# EAGLE schematic ESP-12E Dev Board_with_level_shifter (EAGLE 9.4.0)

## Sheet 1 of 2
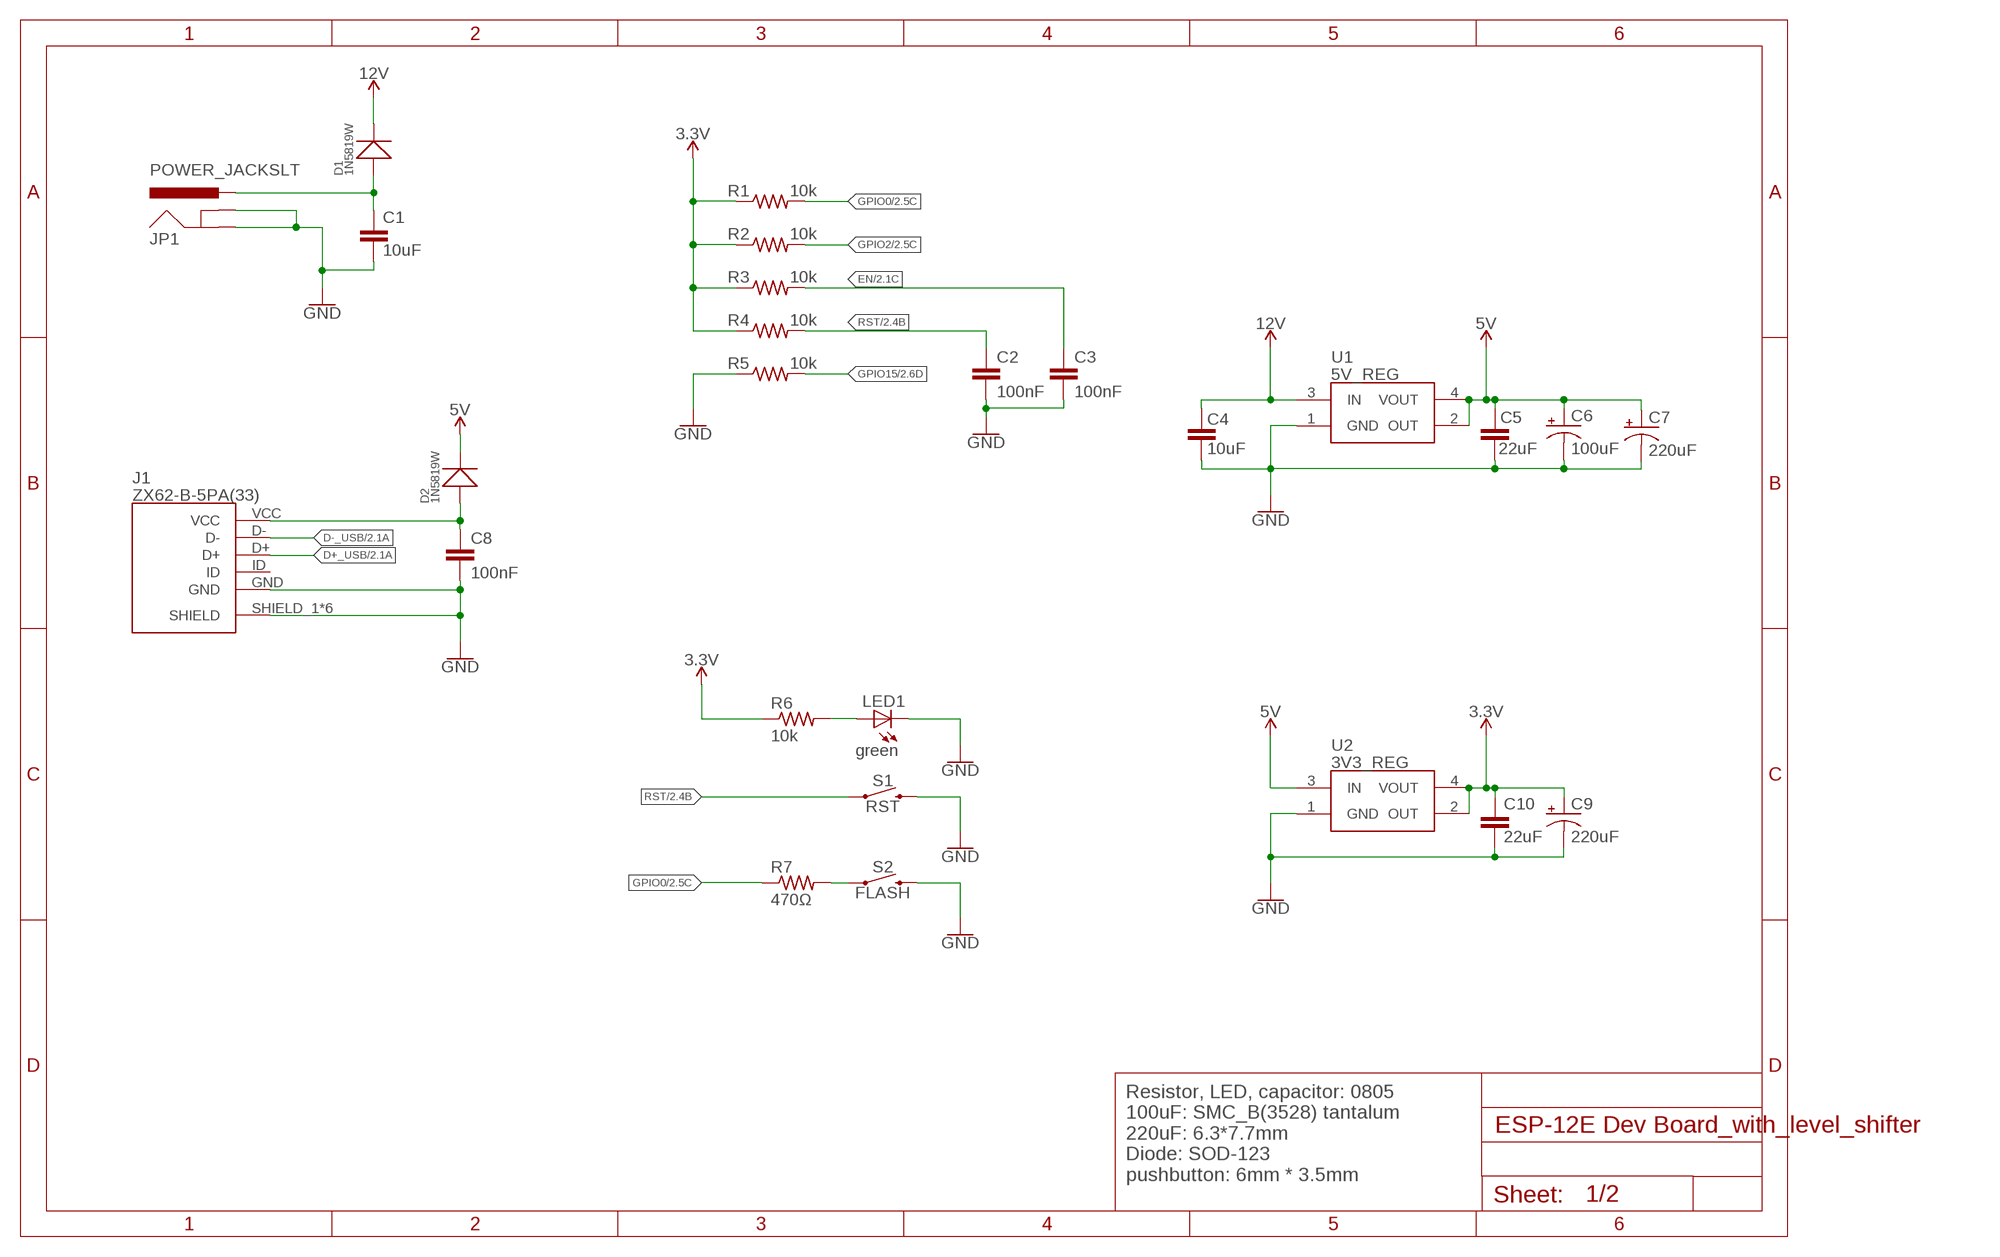
[diagram p0: schematic, sheet 1]

### Parts
C1  10uF  C-EUC0805  [C0805]
C2  100nF  C-EUC0805  [C0805]
C3  100nF  C-EUC0805  [C0805]
C4  10uF  C-EUC0805  [C0805]
C5  22uF  C-EUC0805  [C0805]
C6  100uF  CPOL-USSMCB  [SMC_B]
C7  220uF  CPOL-USUD-6,3X7,7  [UD-6,3X7,7_NICHICON]
C8  100nF  C-EUC0805  [C0805]
C9  220uF  CPOL-USUD-6,3X7,7  [UD-6,3X7,7_NICHICON]
C10  22uF  C-EUC0805  [C0805]
D1  1N5819W  SMD-DIODE-SCHOTTKY-20V-500MA(SOD-123)  [SOD-123]
D2  1N5819W  SMD-DIODE-SCHOTTKY-20V-500MA(SOD-123)  [SOD-123]
J1  ZX62-B-5PA(33)  [ZX62B5PA33]
JP1  POWER_JACKSLT  [POWER_JACK_SLOT]
LED1  green  LEDCHIP-LED0805  [CHIP-LED0805]
R1  10k  R-US_R0805  [R0805]
R2  10k  R-US_R0805  [R0805]
R3  10k  R-US_R0805  [R0805]
R4  10k  R-US_R0805  [R0805]
R5  10k  R-US_R0805  [R0805]
R6  10k  R-US_R0805  [R0805]
R7  470Ω  R-US_R0805  [R0805]
S1  RST  MOMENTARY-SWITCH-SPST-SMD-6.0X3.5MM  [TACTILE_SWITCH_SMD_6.0X3.5MM]
S2  FLASH  MOMENTARY-SWITCH-SPST-SMD-6.0X3.5MM  [TACTILE_SWITCH_SMD_6.0X3.5MM]
U1  5V_REG  AZ1117H-5.0TRE1  [SOT230P700X170-4N]
U2  3V3_REG  AZ1117H-5.0TRE1  [SOT230P700X170-4N]

### Nets
3.3V [power]: C9.+ C10.2 R1.1 R2.1 R3.1 R4.1 R6.1 U2.2(OUT) U2.4(VOUT) ; also sheet 2
5V [power]: C5.1 C6.+ C7.+ D2.- U1.2(OUT) U1.4(VOUT) U2.3(IN) ; also sheet 2
12V [power]: C4.1 D1.- U1.3(IN) ; also sheet 2
D+_USB: J1.D+ ; also sheet 2
D-_USB: J1.D- ; also sheet 2
EN: C3.2 R3.2 ; also sheet 2
GND [power]: C1.1 C2.1 C3.1 C4.2 C5.2 C6.- C7.- C8.1 C9.- C10.1 J1.GND J1.SHIELD_1(SHIELD) J1.SHIELD_2(SHIELD) J1.SHIELD_3(SHIELD) J1.SHIELD_4(SHIELD) J1.SHIELD_5(SHIELD) J1.SHIELD_6(SHIELD) JP1.GND@1(GNDBREAK) JP1.GND@2(GND) LED1.C R5.1 S1.2 S2.2 U1.1(GND) U2.1(GND) ; also sheet 2
GPIO0: R1.2 R7.1 ; also sheet 2
GPIO2: R2.2 ; also sheet 2
GPIO15: R5.2 ; also sheet 2
N$3: C1.2 D1.+ JP1.PWR
N$4: LED1.A R6.2
N$10 [power]: C8.2 D2.+ J1.VCC
POWER1: R7.2 S2.1
RST: C2.2 R4.2 S1.1 ; also sheet 2
Unconnected: J1.ID

### Notes on the sheet
- Resistor, LED, capacitor: 0805
  100uF: SMC_B(3528) tantalum
  220uF: 6.3*7.7mm
  Diode: SOD-123
  pushbutton: 6mm * 3.5mm

## Sheet 2 of 2
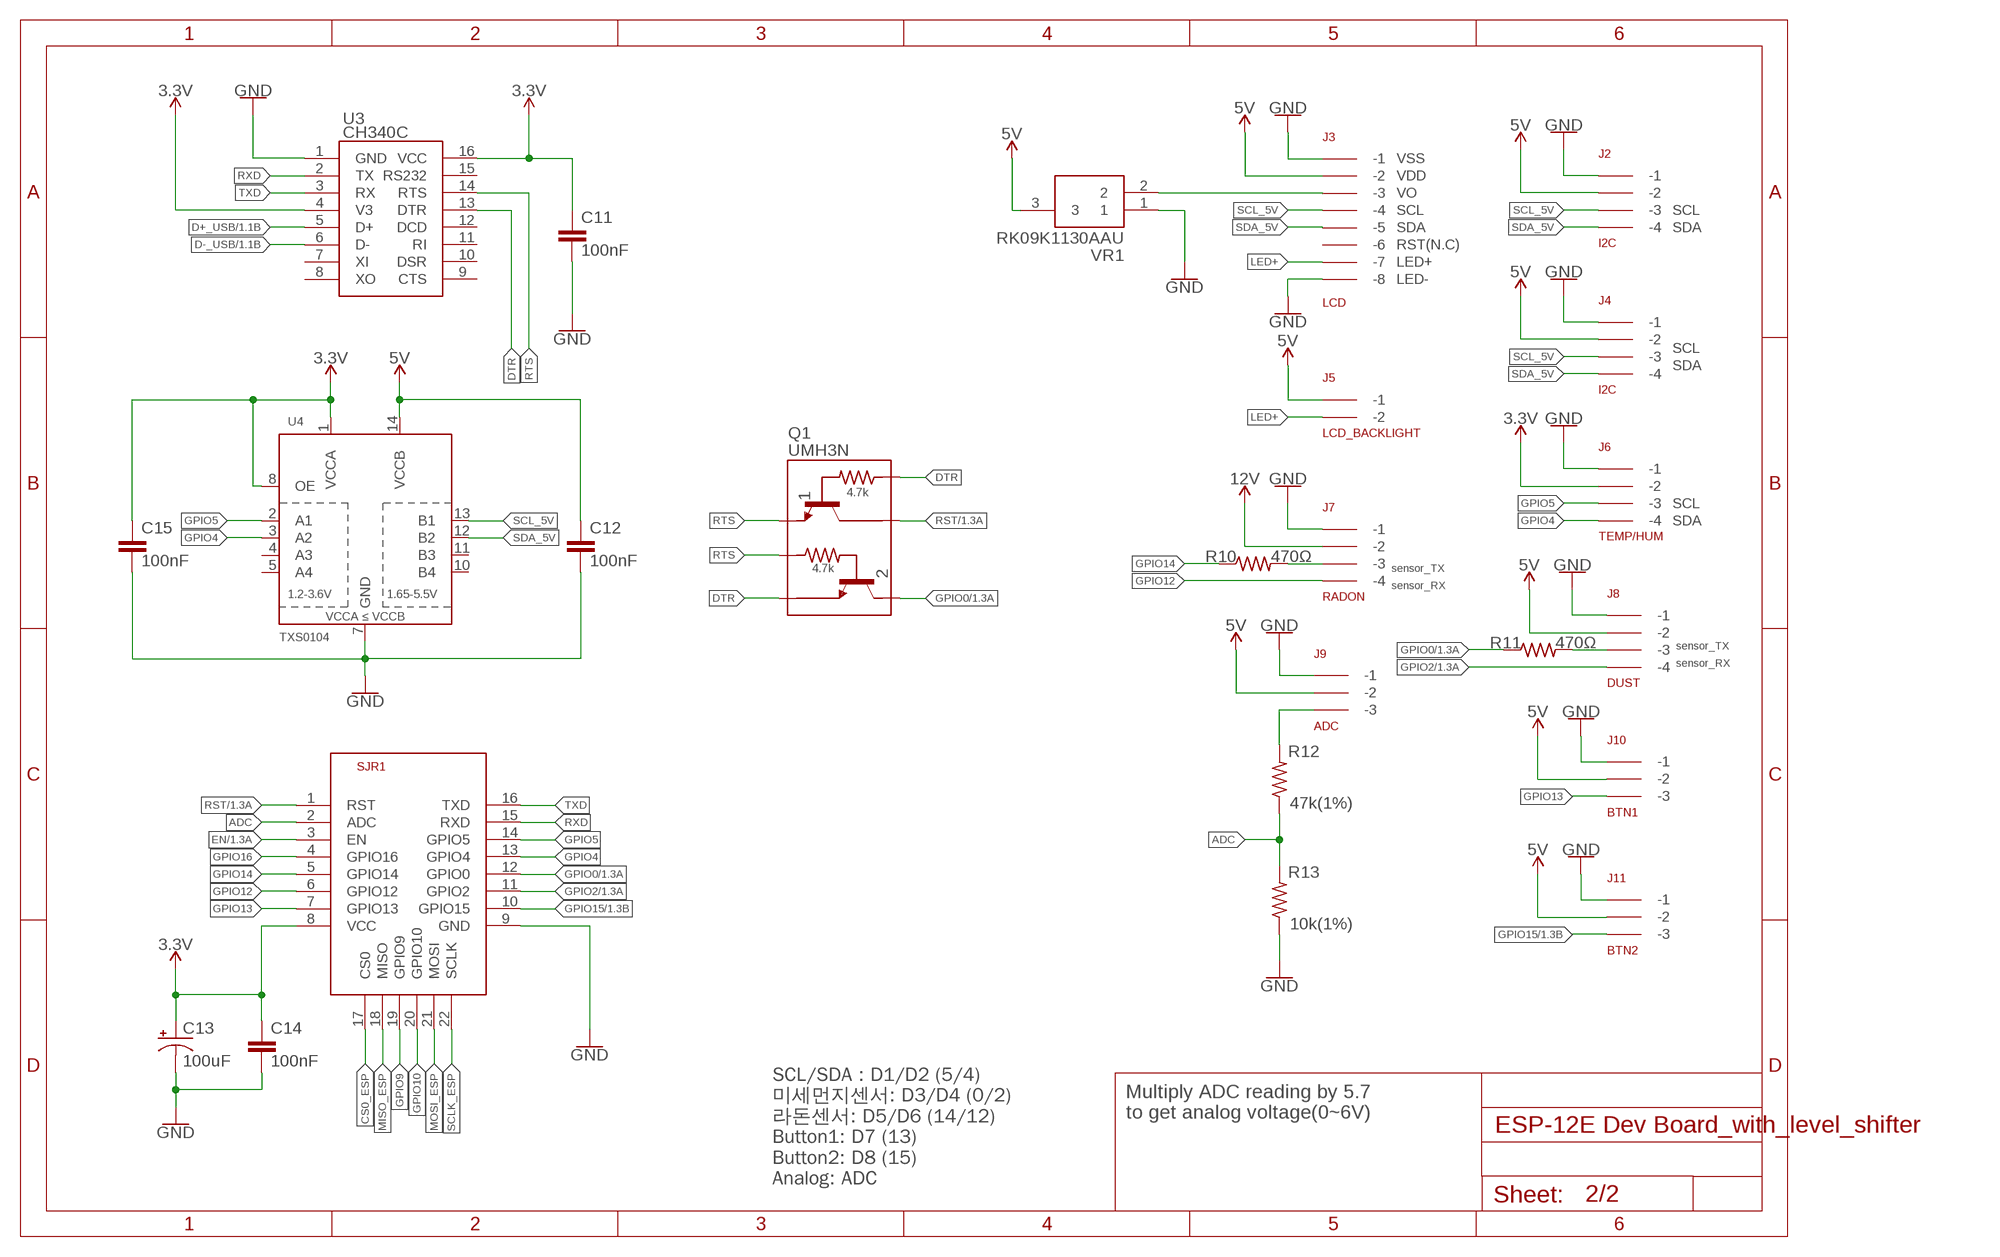
[diagram p1: schematic, sheet 2]

### Parts
C11  100nF  C-EUC0805  [C0805]
C12  100nF  C-EUC0805  [C0805]
C13  100uF  CPOL-USSMCB  [SMC_B]
C14  100nF  C-EUC0805  [C0805]
C15  100nF  C-EUC0805  [C0805]
J2  I2C  5267-4  [5267-4]
J3  LCD  5267-8  [5267-8]
J4  I2C  5267-4  [5267-4]
J5  LCD_BACKLIGHT  5267-2  [5267-2]
J6  TEMP/HUM  5267-4  [5267-4]
J7  RADON  5267-4  [5267-4]
J8  DUST  5267-4  [5267-4]
J9  ADC  5267-3  [5267-3]
J10  BTN1  5267-3  [5267-3]
J11  BTN2  5267-3  [5267-3]
Q1  UMH3N  UMH3NFHATN  [SOT65P210X100-6N]
R10  470Ω  R-US_R0805  [R0805]
R11  470Ω  R-US_R0805  [R0805]
R12  47k(1%)  R-US_R0805  [R0805]
R13  10k(1%)  R-US_R0805  [R0805]
SJR1  ESP-12E  ESP8266-12EESP12E  [ESP8266-ESP12E]
U3  CH340C  CH340G  [SOIC16]
U4  TXS0104  TXB0104PWR  [TSSOP14]
VR1  RK09K1130AAU  RK09K1130A6S  [RK09K1130BGM]

### Nets
3.3V [power]: C11.2 C13.+ C14.2 C15.2 J6.P$2(-2) SJR1.8(VCC) U3.4(V3) U3.16(VCC) U4.1(VCCA) U4.8(OE) ; also sheet 1
5V [power]: C12.2 J2.P$2(-2) J3.P$2(-2) J4.P$2(-2) J5.P$1(-1) J8.P$2(-2) J9.P$2(-2) J10.P$2(-2) J11.P$2(-2) U4.14(VCCB) VR1.3 ; also sheet 1
12V [power]: J7.P$2(-2) ; also sheet 1
ADC: R12.1 R13.2 SJR1.2(ADC)
CS0_ESP: SJR1.17(CS0)
D+_USB: U3.5(D+) ; also sheet 1
D-_USB: U3.6(D-) ; also sheet 1
DTR: Q1.2 Q1.4 U3.13(DTR)
EN: SJR1.3(EN) ; also sheet 1
GND [power]: C11.1 C12.1 C13.- C14.1 C15.1 J2.P$1(-1) J3.P$1(-1) J3.P$8(-8) J4.P$1(-1) J6.P$1(-1) J7.P$1(-1) J8.P$1(-1) J9.P$1(-1) J10.P$1(-1) J11.P$1(-1) R13.1 SJR1.9(GND) U3.1(GND) U4.7(GND) VR1.1 ; also sheet 1
GPIO0: Q1.3 R11.1 SJR1.12(GPIO0) ; also sheet 1
GPIO2: J8.P$4(-4) SJR1.11(GPIO2) ; also sheet 1
GPIO4: J6.P$4(-4) SJR1.13(GPIO4) U4.3(A2)
GPIO5: J6.P$3(-3) SJR1.14(GPIO5) U4.2(A1)
GPIO9: SJR1.19(GPIO9)
GPIO10: SJR1.20(GPIO10)
GPIO12: J7.P$4(-4) SJR1.6(GPIO12)
GPIO13: J10.P$3(-3) SJR1.7(GPIO13)
GPIO14: R10.1 SJR1.5(GPIO14)
GPIO15: J11.P$3(-3) SJR1.10(GPIO15) ; also sheet 1
GPIO16: SJR1.4(GPIO16)
LED+: J3.P$7(-7) J5.P$2(-2)
MISO_ESP: SJR1.18(MISO)
MOSI_ESP: SJR1.21(MOSI)
N$2: J3.P$3(-3) VR1.2
N$5: J9.P$3(-3) R12.2
N$6: J7.P$3(-3) R10.2
N$9: J8.P$3(-3) R11.2
RST: Q1.6 SJR1.1(RST) ; also sheet 1
RTS: Q1.1 Q1.5 U3.14(RTS)
RXD: SJR1.15(RXD) U3.2(TX)
SCL_5V: J2.P$3(-3) J3.P$4(-4) J4.P$3(-3) U4.13(B1)
SCLK_ESP: SJR1.22(SCLK)
SDA_5V: J2.P$4(-4) J3.P$5(-5) J4.P$4(-4) U4.12(B2)
TXD: SJR1.16(TXD) U3.3(RX)
Unconnected: J3.P$6(-6) U3.7(XI) U3.8(XO) U3.9(CTS) U3.10(DSR) U3.11(RI) U3.12(DCD) U3.15(RS232) U4.4(A3) U4.5(A4) U4.10(B4) U4.11(B3)

### Notes on the sheet
- VSS
- VDD
- VO
- SCL | SCL
- SDA | SDA
- RST(N.C)
- LED+
- LED-
- SCL
- SDA
- SCL
- SDA
- sensor_TX
- sensor_RX
- sensor_TX
- sensor_RX
- SCL/SDA : D1/D2 (5/4)
  미세먼지센서: D3/D4 (0/2)
  라돈센서: D5/D6 (14/12)
  Button1: D7 (13)
  Button2: D8 (15)
  Analog: ADC
- Multiply ADC reading by 5.7
  to get analog voltage(0~6V)

## Library data of the parts
C1-C5 C8 C10-C12 C14 C15 = rcl:C-EU: CAPACITOR, European symbol; SPICEPREFIX: C
C6 C7 C9 C13 = rcl:CPOL-US: POLARIZED CAPACITOR, American symbol; SPICEPREFIX: C
D1 D2 = Seeed-Diode:SMD-DIODE-SCHOTTKY-20V-500MA(SOD-123): 304020032; MPN: SS0520-7-F; VALUE: 20V-500MA
J1 = SamacSys_Parts:ZX62-B-5PA(33): USB Connectors MICRO B RECEPT RA SMT BTTM MNT Source: Datasheet <https://componentsearchengine.com/Datasheets/1/ZX62-B-5PA(33).pdf>; DESCRIPTION: USB Connectors MICRO B RECEPT RA SMT BTTM MNT; HEIGHT: 2.8mm; MANUFACTURER_NAME: Hirose; MANUFACTURER_PART_NUMBER: ZX62-B-5PA(33); MOUSER_PART_NUMBER: 798-ZX62-B-5PA33; MOUSER_PRICE-STOCK: https://www.mouser.com/Search/Refine.aspx?Keyword=798-ZX62-B-5PA33
J2 J4 J6-J8 = con-molex-spox:5267-4
J3 = con-molex-spox:5267-8
J5 = con-molex-spox:5267-2
J9-J11 = con-molex-spox:5267-3
JP1 = kanflo:POWER_JACK: Power Jack This is the standard 5.5mm barrel jack for power. The SLT footprint has been proven in designs produced by DirtyPCBs.com and only works if the mill layer is transmitted to the PCB fab house and the fab house accepts it. Rumours has it OSH Park accepts this design too. This symbol is meant for the cheap PCB mount connectors you find on eBay, retailing at less than 2EUR/10pcs (search for "dc power jack 5.5 2.1 pcb"). The difference between these and the ones sold by eg. SparkFun is the location of the pads relative to the plastic body.
LED1 = adafruit:LED: LED OSRAM: - CHIPLED LG R971, LG N971, LY N971, LG Q971, LY Q971, LO R971, LY R971 LH N974, LH R974 LS Q976, LO Q976, LY Q976 LO Q996 - Hyper CHIPLED LW Q18S LB Q993, LB Q99A, LB R99A - SideLED LS A670, LO A670, LY A670, LG A670, LP A670 LB A673, LV A673, LT A673, LW A673 LH A674 LY A675 LS A676, LA A676, LO A676, LY A676, LW A676 LS A679, LY A679, LG A679 - Hyper Micro SIDELED® LS Y876, LA Y876, LO Y876, LY Y876 LT Y87S - SmartLED LW L88C, LW L88S LB L89C, LB L89S, LG L890 LS L89K, LO L89K, LY L89K LS L896, LA L896, LO L896, LY L896 - TOPLED LS T670, LO T670, LY T670, LG T670, LP T670 LSG T670, LSP T670, LSY T670, LOP T670, LYG T670 LG T671, LOG T671, LSG T671 LB T673, LV T673, LT T673, LW T673 LH T674 LS T676, LA T676, LO T676, LY T676, LB T676, LH T676, LSB T676, LW T676 LB T67C, LV T67C, LT T67C, LS T67K, LO T67K, LY T67K, LW E67C LS E67B, LA E67B, LO E67B, LY E67B, LB E67C, LV E67C, LT E67C LW T67C LS T679, LY T679, LG T679 LS T770, LO T770, LY T770, LG T770, LP T770 LB T773, LV T773, LT T773, LW T773 LH T774 LS E675, LA E675, LY E675, LS T675 LS T776, LA T776, LO T776, LY T776, LB T776 LHGB T686 LT T68C, LB T68C - Hyper Mini TOPLED® LB M676 - Mini TOPLED Santana® LG M470 LS M47K, LO M47K, LY M47K Source: http://www.osram.convergy.de/
Q1 = SamacSys_Parts:UMH3NFHATN: ROHM - UMH3NFHATN - TRANS, NPN, AUTO, 4.7K/4.7K, SOT-353 Source: Datasheet <http://www.rohm.com/web/global/datasheet/UMH3NFHA/umh3nfha-e>; DESCRIPTION: ROHM - UMH3NFHATN - TRANS, NPN, AUTO, 4.7K/4.7K, SOT-353; HEIGHT: 1mm; MANUFACTURER_NAME: ROHM Semiconductor; MANUFACTURER_PART_NUMBER: UMH3NFHATN; MOUSER_PART_NUMBER: 755-UMH3NFHATN; MOUSER_PRICE-STOCK: https://www.mouser.com/Search/Refine.aspx?Keyword=755-UMH3NFHATN
R1-R7 R10-R13 = rcl:R-US_: RESISTOR, American symbol; SPICEPREFIX: R
S1 S2 = SparkFun-Switches:MOMENTARY-SWITCH-SPST: Momentary Switch (Pushbutton) - SPST Normally-open (NO) SPST momentary switches (buttons, pushbuttons). Variants PTH-12MM - 12mm square, through-hole Momentary Pushbutton Switch - 12mm Square <https://www.sparkfun.com/products/9190> (COM-09190) PTH-6.0MM, PTH-6.0MM-KIT - 6.0mm square, through-hole Mini Pushbutton Switch <https://www.sparkfun.com/products/97> (COM-00097) KIT package intended for soldering kit's - only one side of pads' copper is exposed. PTH-RIGHT-ANGLE-KIT - Right-angle, through-hole Right Angle Tactile Button <https://www.sparkfun.com/products/10791> - Used on SparkFun BigTime Watch Kit <https://www.sparkfun.com/products/11734> SMD-12MM - 12mm square, surface-mount Tactile Button - SMD (12mm) <https://www.sparkfun.com/products/12993> (COM-12993) Used on SparkFun PicoBoard <https://www.sparkfun.com/products/11888> SMD-4.5MM - 4.5mm Square Trackball Switch Used on SparkFun Blackberry Trackballer Breakout <https://www.sparkfun.com/products/13169> SMD-4.6MMX2.8MM - 4.60mm x 2.80mm, surface mount Used on SparkFun SAMD21 Mini Breakout <https://www.sparkfun.com/products/13664> SMD-5.2MM, SMD-5.2-REDUNDANT - 5.2mm square, surface-mount Mini Pushbutton Switch - SMD <https://www.sparkfun.com/products/8720> (COM-08720) Used on Arduino Pro Mini <https://www.sparkfun.com/products/11114> REDUNDANT package connects both switch circuits together SMD-6.0X3.5MM - 6.0 x 3.5mm, surface mount Momentary Reset Switch SMD <https://www.sparkfun.com/products/8229> (COM-08229) SMD-6.2MM-TALL - 6.2mm square, surface mount Tactile Button - SMD (6mm) <https://www.sparkfun.com/products/12992> Used on SparkFun Digital Sandbox <https://www.sparkfun.com/products/12651> SMD-RIGHT-ANGLE - Right-angle, surface mount Used on SparkFun Block for Intel® Edison - Arduino <https://www.sparkfun.com/products/13036>; PROD_ID: SWCH-00815; SF_SKU: COM-08229
SJR1 = esp12e:ESP8266-12E: ESP8266-12E Library for Eagle CAD The author not responsible for any damages or errors!. Created by Suhail jr.lt;/author>
U1 U2 = SamacSys_Parts:AZ1117H-5.0TRE1: 1A 5V LDO Linear Voltage Reg SOT-223 Diodes Inc AZ1117H-5.0TRE1, Single Linear Voltage Regulator, 1A 4.9 5.1 V, 1%, 3-Pin SOT-223 Source: Datasheet <https://componentsearchengine.com/Datasheets/1/AZ1117H-5.0TRE1.pdf>; DESCRIPTION: 1A 5V LDO Linear Voltage Reg SOT-223 Diodes Inc AZ1117H-5.0TRE1, Single Linear Voltage Regulator, 1A 4.9 5.1 V, 1%, 3-Pin SOT-223; HEIGHT: 1.7mm; MANUFACTURER_NAME: Diodes Inc.; MANUFACTURER_PART_NUMBER: AZ1117H-5.0TRE1; MOUSER_PART_NUMBER: 621-AZ1117H-5.0TRE1; MOUSER_PRICE-STOCK: https://www.mouser.com/Search/Refine.aspx?Keyword=621-AZ1117H-5.0TRE1
U3 = ch340g:CH340G
U4 = SparkFun-IC-Comms:TXB0104PWR: 4-Bit Bi-Directional Level Shifter 1.2V-3.6V (VCCA) to 1.65V-5.5V (VCCB) bi-directional level shifter with auto direction sensing. Max data rate - VCCA 1.8V: 20Mbps (50ns), VCCA 3.3V: 100Mbps (10ns) Digikey: 296-21929-1-ND (TSSOP) Datasheet <http://cdn.sparkfun.com/datasheets/BreakoutBoards/txb0104.pdf> SparkFun Products SparkFun Cellular Shield - MG2639 <https://www.sparkfun.com/products/13120> (CEL-13120) SparkFun Level Shifting microSD Breakout <https://www.sparkfun.com/products/13743> (DEV-13743) SparkFun Voltage-Level Translator Breakout - TXB0104 <https://www.sparkfun.com/products/11771> (BOB-11771) SparkFun Block for Intel® Edison - UART <https://www.sparkfun.com/products/13040> (DEV-13040) SparkFun Block for Intel® Edison - Arduino <https://www.sparkfun.com/products/13036> (DEV-13036); PROD_ID: NA-XXXXX; VALUE: TXB0104
VR1 = SamacSys_Parts:RK09K1130A6S: Audio single pot. 10K Vertical 15mm,1B Alps RK09K Series, Linear Potentiometer with a 6 mm Dia. Shaft, 10k, +/-20%, Through Hole Source: Datasheet <https://componentsearchengine.com/Datasheets/1/RK09K1130A6S.pdf>; DESCRIPTION: Audio single pot. 10K Vertical 15mm,1B Alps RK09K Series, Linear Potentiometer with a 6 mm Dia. Shaft, 10k, +/-20%, Through Hole; HEIGHT: mm; MANUFACTURER_NAME: ALPS; MANUFACTURER_PART_NUMBER: RK09K1130A6S; MOUSER_PART_NUMBER: 688-RK09K1130A6S; MOUSER_PRICE-STOCK: https://www.mouser.com/Search/Refine.aspx?Keyword=688-RK09K1130A6S

## Net classes
1 power: width 0.457 mm